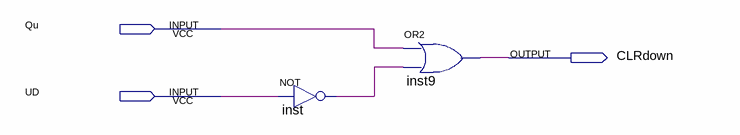
[diagram p0: schematic sheet]
// Quartus schematic CLRdown.bdf as structural Verilog: 2 symbols, 3 pins
module CLRdown (
  input  Qu,
  input  UD,
  output CLRdown
);

  wire inst_out;

  not inst (inst_out, UD);
  or inst9 (CLRdown, Qu, inst_out);
endmodule
